# EAGLE design vdo_regulator (EAGLE 7.7.0)
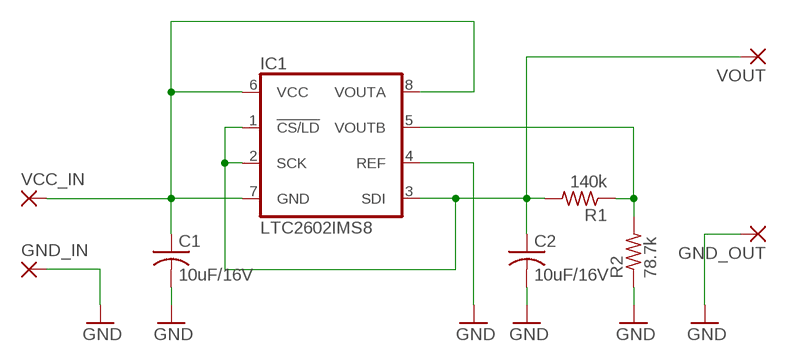
[diagram p0: schematic, sheet 1]

## Parts
C1  10uF/16V  C-US025-025X050  [C025-025X050]
C2  10uF/16V  C-US025-025X050  [C025-025X050]
GND_IN  2,54/0,9  [2,54/0,9]
GND_OUT  2,54/0,9  [2,54/0,9]
IC1  LTC2602IMS8  [MSOP8]
R1  140k  R-US_0309/10  [0309/10]
R2  78.7k  R-US_0309/10  [0309/10]
VCC_IN  2,54/0,9  [2,54/0,9]
VOUT  2,54/0,9  [2,54/0,9]

## Nets
GND: C1.2 C2.2 GND_IN.1(P) GND_OUT.1(P) IC1.4(REF) R2.1
N$1: C1.1 IC1.6(VCC) IC1.7(GND) IC1.8(VOUTA) VCC_IN.1(P)
N$2: C2.1 IC1.1(!CS/LD) IC1.2(SCK) IC1.3(SDI) R1.2 VOUT.1(P)
N$3: IC1.5(VOUTB) R1.1 R2.2

## Library data of the parts
C1 C2 = resistor:C-US: CAPACITOR, American symbol
GND_IN GND_OUT VCC_IN VOUT = wirepad:2,54/0,9: THROUGH-HOLE PAD
IC1 = linear-technology:LTC26*: Dual 16-/14-/12-Bit Rail-to-Rail DACs Source: www.linear.com; MPN: LTC2602IMS8; OC_FARNELL: 1663694; OC_NEWARK: 56M5822
R1 R2 = resistor:R-US_: RESISTOR, American symbol

## Board
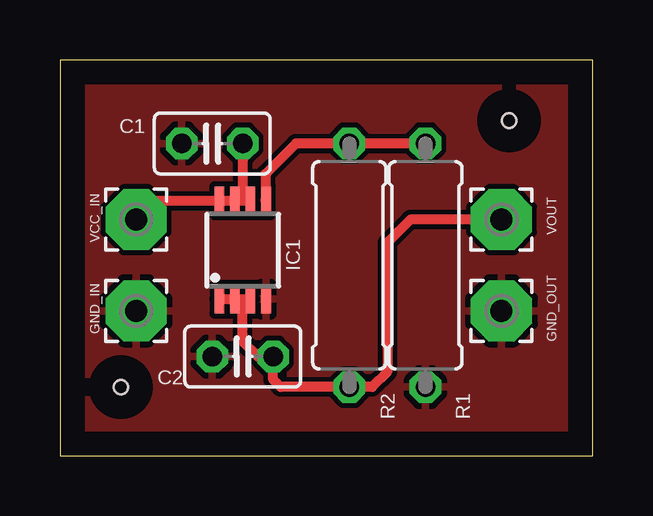
[diagram p1: board, top side]
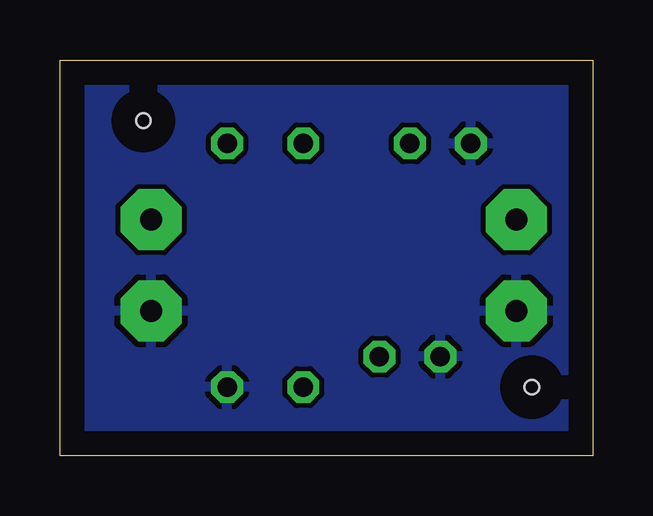
[diagram p2: board, bottom side, seen from below]

Size 22.21 x 16.5 mm. Coordinates in mm from the lower left corner, seen from the top.
Outline: 0,0 22.21,0 22.21,16.5 0,16.5 0,0
Copper layers (1*16): Top 0.035mm / dielectric 1.5mm / Bottom 0.035mm
Design rules "default": minimum track width 10mil, minimum drill 24mil, track to track 8mil, track to pad 8mil, pad to pad 8mil, via to via 8mil, smd to smd 8mil, copper to edge 40mil, drill to drill 8mil, minimum pad ring 10mil, minimum via ring 8mil, stop-mask expansion 4mil, vias tented up to drill 0mil, thermal gap 10mil
Holes 0.6 mm at 2.54,2.86 18.73,13.97

### Footprints (pad centres in the part's own frame; a part is rotated, then mirrored left to right if it is on the bottom)
C025-025X050 = drill 0.813 octagon: 1 -1.27,0; 2 1.27,0
2,54/0,9 = drill 0.914 pad 2.54 octagon: 1 0,0
MSOP8 = smd 0.4 x 1.2: 1 -0.975,-2.05; 2 -0.325,-2.05; 3 0.325,-2.05; 4 0.975,-2.05; 5 0.975,2.05; 6 0.325,2.05; 7 -0.325,2.05; 8 -0.975,2.05
0309/10 = drill 0.813 octagon: 1 -5.08,0; 2 5.08,0

### Placement (x,y rotation side)
C1  6.35,13.02 180 top
C2  7.62,4.13 180 top
GND_IN  3.17,6.03 0 top
GND_OUT  18.41,6.03 0 top
IC1  7.62,8.57 0 top
R1  12.06,7.94 270 top
R2  15.24,7.94 90 top
VCC_IN  3.17,9.84 0 top
VOUT  18.41,9.84 0 top

### Tracks (layer width: path | path; a pad name or v marks a point on that pad's centre or on a via)
GND
  pour Top: 0,16.51 0,0 22.22,0 22.22,16.51
  pour Bottom: 0,16.51 0,0 22.22,0 22.22,16.51
N$1
  Top 0.406: IC1.6 IC1.7 | IC1.7 IC1.8 3.96,10.62 VCC_IN.1 | C1.1 7.62,10.95 IC1.7
N$2
  Top 0.406: IC1.1 IC1.2 | IC1.2 IC1.3 | IC1.2 7.62,6.2 7.62,4.76 8.26,4.13 C2.1 8.89,3.18 9.21,2.86 R1.2 13.02,2.86 13.65,3.49 13.65,8.89 14.61,9.84 VOUT.1
N$3
  Top 0.406: R2.2 R1.1 9.84,13.02 8.57,11.75 8.57,10.64 IC1.5